# Altium schematic sheet Supply.SchDoc
size A2; Date: Date; CompanyName: HESSO; Engineer: Name; Address1: Route du Rawyl 47; Address2: 1950 Sion; Address3: Switzerland; DocumentNumber: 2; SheetNumber: 2; SheetTotal: 8; ProjectName: Project Name
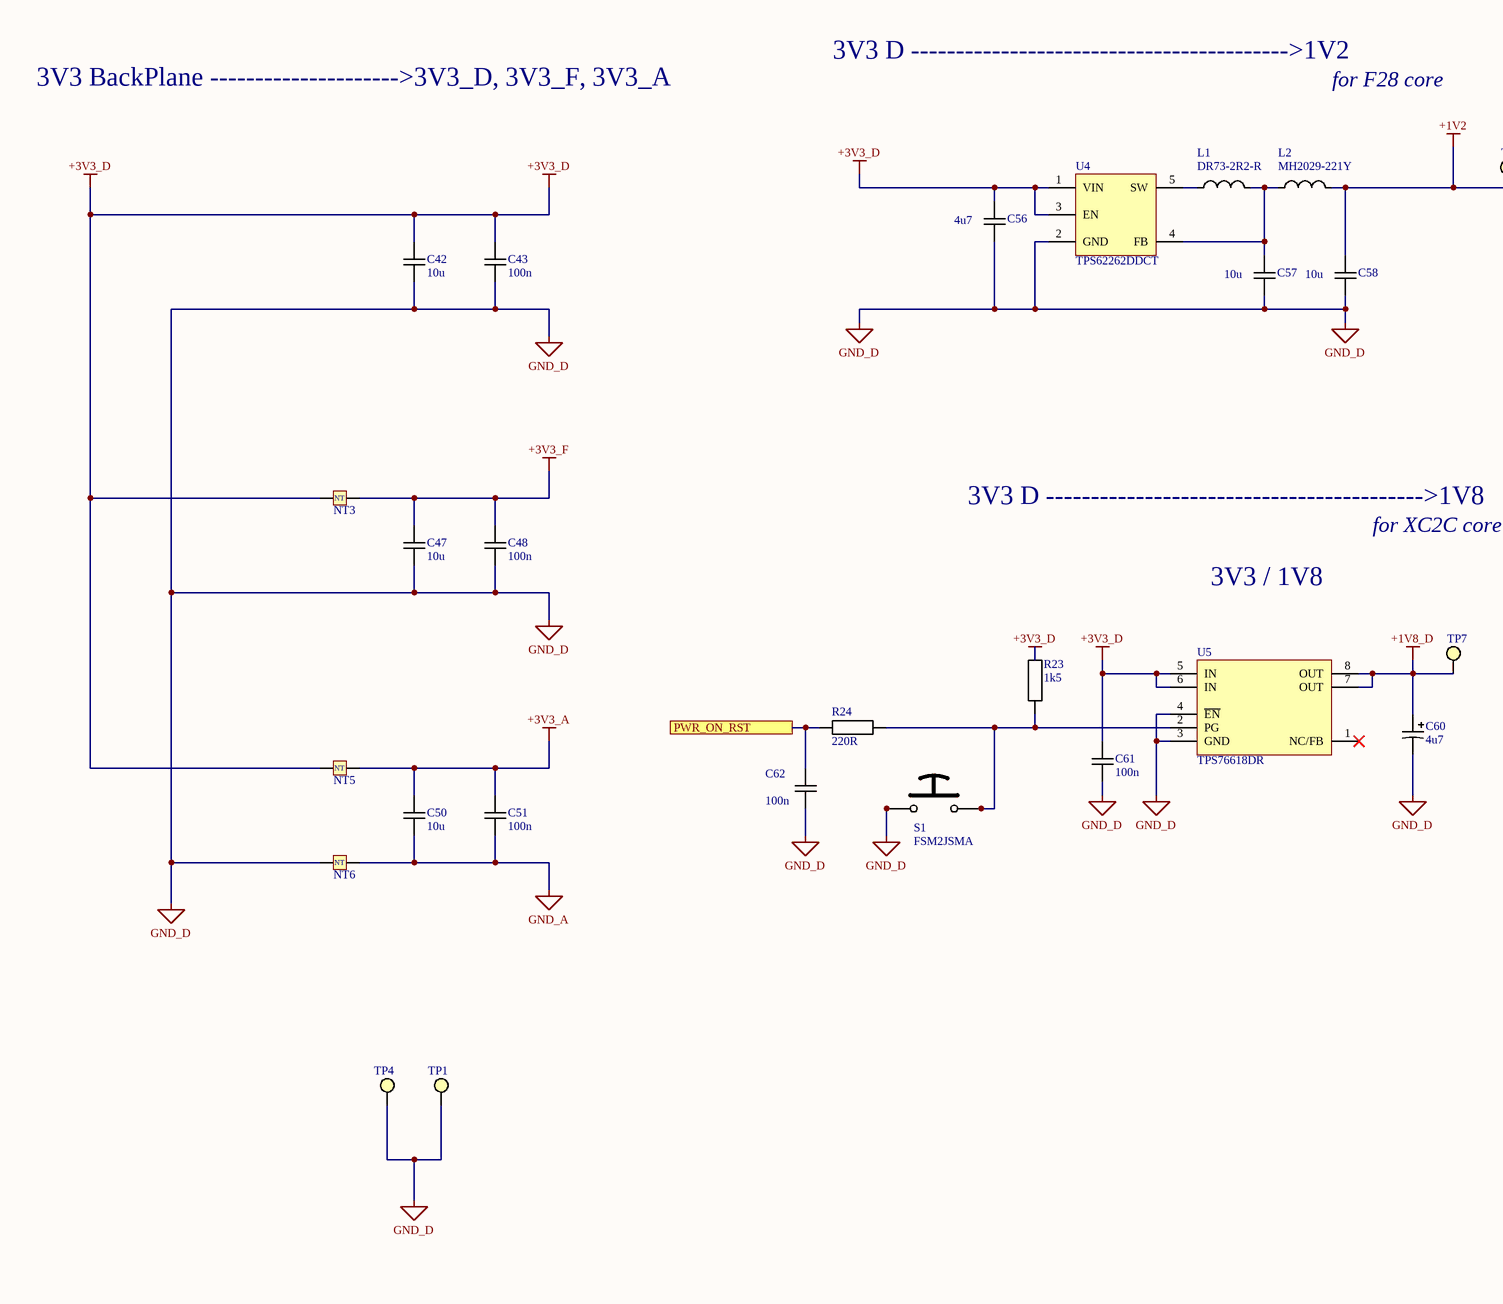
[diagram p0: Supply.SchDoc, left]
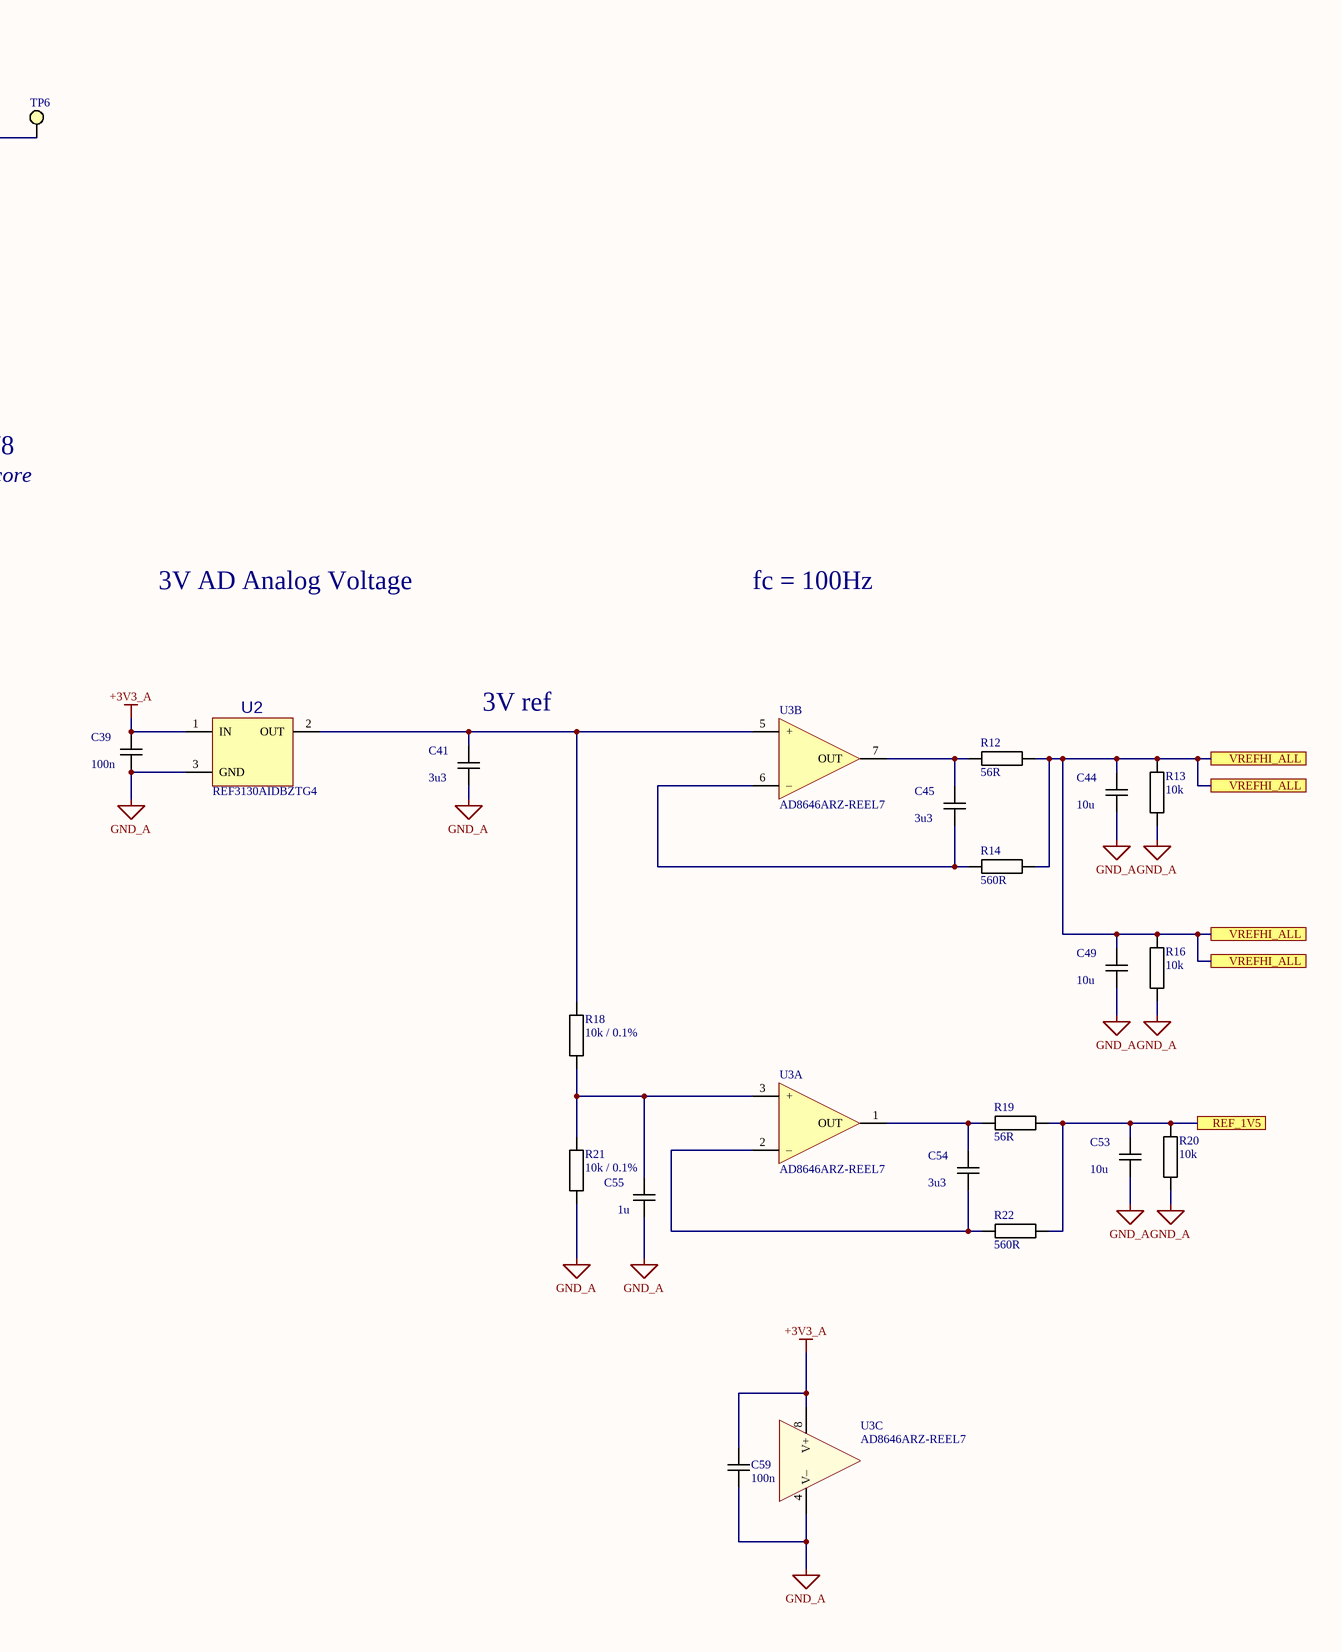
[diagram p1: Supply.SchDoc, right]

## Parts
C39  100n  [CAPACITOR 1608 REFLOW]
C41  3u3  [CAPACITOR 2012 REFLOW]
C42  10u  [CAPACITOR 2012 REFLOW]
C43  100n  [CAPACITOR 2012 REFLOW]
C44  10u  [CAPACITOR 2012 REFLOW]
C45  3u3  [CAPACITOR 2012 REFLOW]
C47  10u  [CAPACITOR 2012 REFLOW]
C48  100n  [CAPACITOR 2012 REFLOW]
C49  10u  [CAPACITOR 2012 REFLOW]
C50  10u  [CAPACITOR 2012 REFLOW]
C51  100n  [CAPACITOR 2012 REFLOW]
C53  10u  [CAPACITOR 2012 REFLOW]
C54  3u3  [CAPACITOR 2012 REFLOW]
C55  1u  [CAPACITOR 2012 REFLOW]
C56  4u7  [CAPACITOR 2012 REFLOW]
C57  10u  [CAPACITOR 2012 REFLOW]
C58  10u  [CAPACITOR 2012 REFLOW]
C59  100n  [CAPACITOR 1608 REFLOW]
C60  4u7  [CAPACITOR POL 3528-21 REFLOW]
C61  100n  [CAPACITOR 1608 REFLOW]
C62  100n  [CAPACITOR 1608 REFLOW]
L1  DR73-2R2-R  [DR73]
L2  MH2029-221Y  [INDUCTOR 2012 REFLOW]
NT3  Net Tie  [NET TIE 1005]  (value not drawn)  (net tie, no BOM)
NT5  Net Tie  [NET TIE 1005]  (value not drawn)  (net tie, no BOM)
NT6  Net Tie  [NET TIE 1005]  (value not drawn)  (net tie, no BOM)
R12  56R  [RESISTOR 1608 REFLOW]
R13  10k  [RESISTOR 1608 REFLOW]
R14  560R  [RESISTOR 1608 REFLOW]
R16  10k  [RESISTOR 1608 REFLOW]
R18  10k / 0.1%  [RESISTOR 1608 REFLOW]
R19  56R  [RESISTOR 1608 REFLOW]
R20  10k  [RESISTOR 1608 REFLOW]
R21  10k / 0.1%  [RESISTOR 1608 REFLOW]
R22  560R  [RESISTOR 1608 REFLOW]
R23  1k5  [RESISTOR 1608 REFLOW]
R24  220R  [RESISTOR 1608 REFLOW]
S1  FSM2JSMA  [Push Button C6.0x6.0 TE FSM-2J-SMA]
TP1  *  [Test Point Keystone Miniature BLACK]  (value not drawn)
TP4  *  [Test Point Keystone Miniature BLACK]  (value not drawn)
TP6  *  [Hole 1.0 D2.0]  (value not drawn)  (no BOM)
TP7  *  [Hole 1.0 D2.0]  (value not drawn)  (no BOM)
U2  REF3130AIDBZTG4  [SOT23 P0.95 C1.6x3.0 H1.3]
U3  AD8646ARZ-REEL7  [SO8 P1.27 C4.0X5.0 H1.75]  (parts A,B,C of 3)
U4  TPS62262DDCT  [SOT23-5 P0.95 C1.6x3.0 H1.3]
U5  TPS76618DR  [SO8 P1.27 C4.0X5.0 H1.75]

## Ports
PWR_ON_RST, REF_1V5, VREFHI_ALL

## Nets
+1V2: C58.2 L2.2 TP6.1
+1V8_D: C60.1 TP7.1 U5.7(OUT) U5.8(OUT)
+3V3_A: C39.2 C50.1 C51.1 C59.2 NT5.2 U2.1(IN) U3.8(V+)
+3V3_D: C42.1 C43.1 C56.2 C61.1 NT3.1 NT5.1 R23.2 U4.1(VIN) U4.3(EN) U5.5(IN) U5.6(IN)
+3V3_F: C47.1 C48.1 NT3.2
GND_A: C39.1 C41.1 C44.1 C49.1 C50.2 C51.2 C53.1 C55.1 C59.1 NT6.2 R13.2 R16.2 R20.2 R21.2 U2.3(GND) U3.4(V–)
GND_D: C42.2 C43.2 C47.2 C48.2 C56.1 C57.1 C58.1 C60.2 C61.2 C62.1 NT6.1 S1.1 S1.2 TP1.1 TP4.1 U4.2(GND) U5.3(GND) U5.4(~{EN})
PWR_ON_RST: C62.2 R24.1 ; port PWR_ON_RST
REF_1V5: C53.2 R19.1 R20.1 R22.1 ; port REF_1V5
VREFHI_ALL: C44.2 C49.2 R12.1 R13.1 R14.1 R16.1 ; port VREFHI_ALL
NetC41_2: C41.2 R18.2 U2.2(OUT) U3.5(+)
NetC45_1: C45.1 R14.2 U3.6(–)
NetC45_2: C45.2 R12.2 U3.7(OUT)
NetC54_1: C54.1 R22.2 U3.2(–)
NetC54_2: C54.2 R19.2 U3.1(OUT)
NetC55_2: C55.2 R18.1 R21.1 U3.3(+)
NetC57_2: C57.2 L1.2 L2.1 U4.4(FB)
NetL1_1: L1.1 U4.5(SW)
NetR23_1: R23.1 R24.2 S1.3 S1.4 U5.2(PG)

Not connected (* = marked no-connect by the designer): U5 1(NC/FB)*

## Notes on the sheet
- 3V3 D ------------------------------------------>1V2
- 3V3 BackPlane --------------------->3V3_D, 3V3_F, 3V3_A
- for F28 core
- 3V3 D ------------------------------------------>1V8
- for XC2C core
- 3V3 / 1V8
- 3V AD Analog Voltage
- fc = 100Hz
- (near C41) 3V ref
- Date :
- Revision :
- Sheet
- of
- Design by :
- (in symbol Net Tie) NT

## Library data of the parts
C39 C59 C61 C62 = Capacitor: Capacitor X7R 10% 50V 1608(0603); Value: 100n
C41 C42 C44 C45 C47 C49 C50 C53-C58 = Capacitor: Capacitor X7R 10% 10V 2012(0805)
  C41 C45 C54: Value: 3u3
  C42 C44 C47 C49 C50 C53 C57 C58: Value: 10u
  C55: Value: 1u
  C56: Value: 4u7
C43 C48 C51 = Capacitor: Capacitor X7R 10% 50V 2012(0805); Value: 100n
C60 = Capacitor Polarized: Capacitor Tantalum 10 % 10V 3528(1311-TAJ-B); Value: 4u7
L1 = Inductor: Manufacturer: Coiltronics / Eaton; Info: 2u2, 4.15A, 16mΩ; Mouser No.: 704-DR73-2R2-R; Value: DR73-2R2-R
L2 = Inductor: Manufacturer: Bourns; Info: 220u, 2A, 220Ω@100Mhz; Mouser No.: 652-MH2029-221Y; Value: MH2029-221Y
NT3 NT5 NT6 = Net Tie: Connection for 2 different NETNAME
R12-R14 R16 R18-R24 = Resistor: Resistor 1% 50V 100mW 1608(0603)
  R12 R19: Value: 56R
  R13 R16 R20: Value: 10k
  R14 R22: Value: 560R
  R18 R21: Value: 10k / 0.1%
  R23: Value: 1k5
  R24: Value: 220R
S1 = Push Button 4Pins: Push Button, 4 pins, 2 poles parrallèle; Manufacturer: TE Connectivity / Alcoswitch; Value: FSM2JSMA; Mouser No.: 506-FSM2JSMA
TP1 TP4 = Test Point: Value: *
TP6 TP7 = Hole: Value: *
U2 = REFERENCE SOT23 IN-OUT- GND: Generic Positive Voltage Reference; Manufacturer: Texas Instruments; Value: REF3130AIDBZTG4; Mouser No.: 595-REF3130AIDBZTG4
U3 = OPA DUAL: Generic dual OPA 8 pins; Manufacturer: Analog Devices; Value: AD8646ARZ-REEL7; Mouser No.: 584-AD8646ARZ-R7
U4 = TPS6226x: 2.25-MHz 600-mA Step Down Converter in 2 x 2 SOT Package; Manufacturer: Texas Instruments; Value: TPS62262DDCT; Mouser No.: 595-TPS62262DDCT
U5 = TPS766__D: Ultra Low Quiescent Current 250mA, Low Dropout Regulator; Manufacturer: Texas Instruments; Value: TPS76618DR; Mouser No.: 595-TPS76618DR